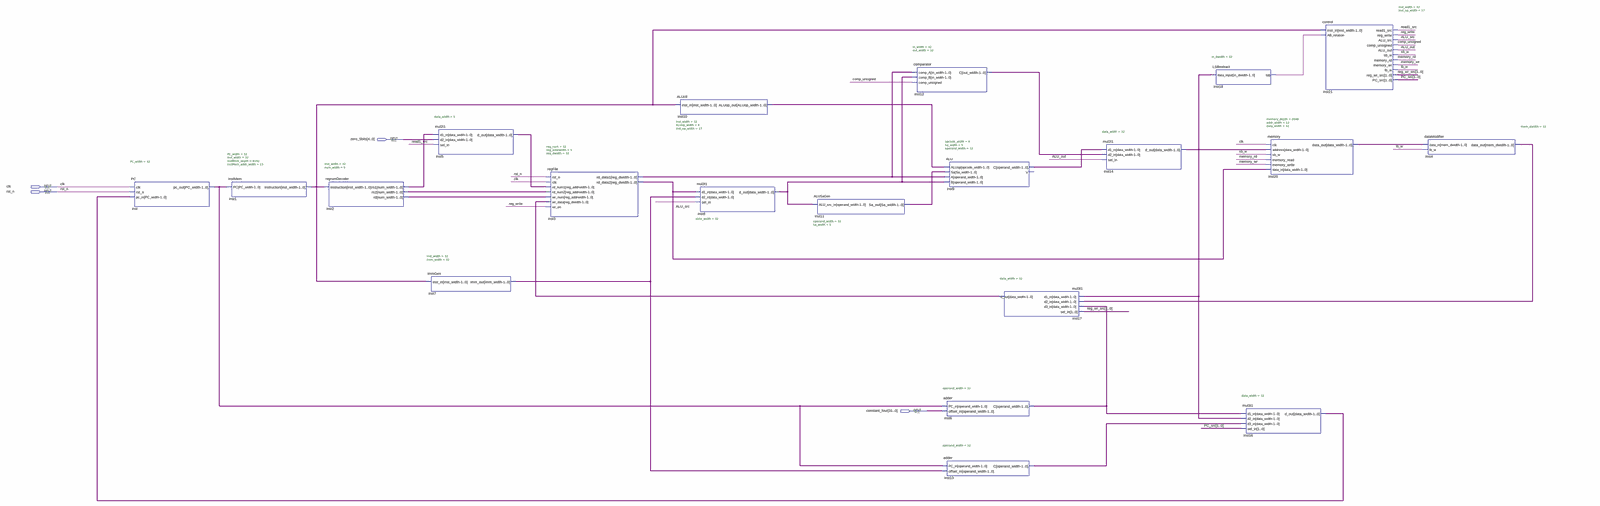
[diagram p0: schematic sheet, whole]
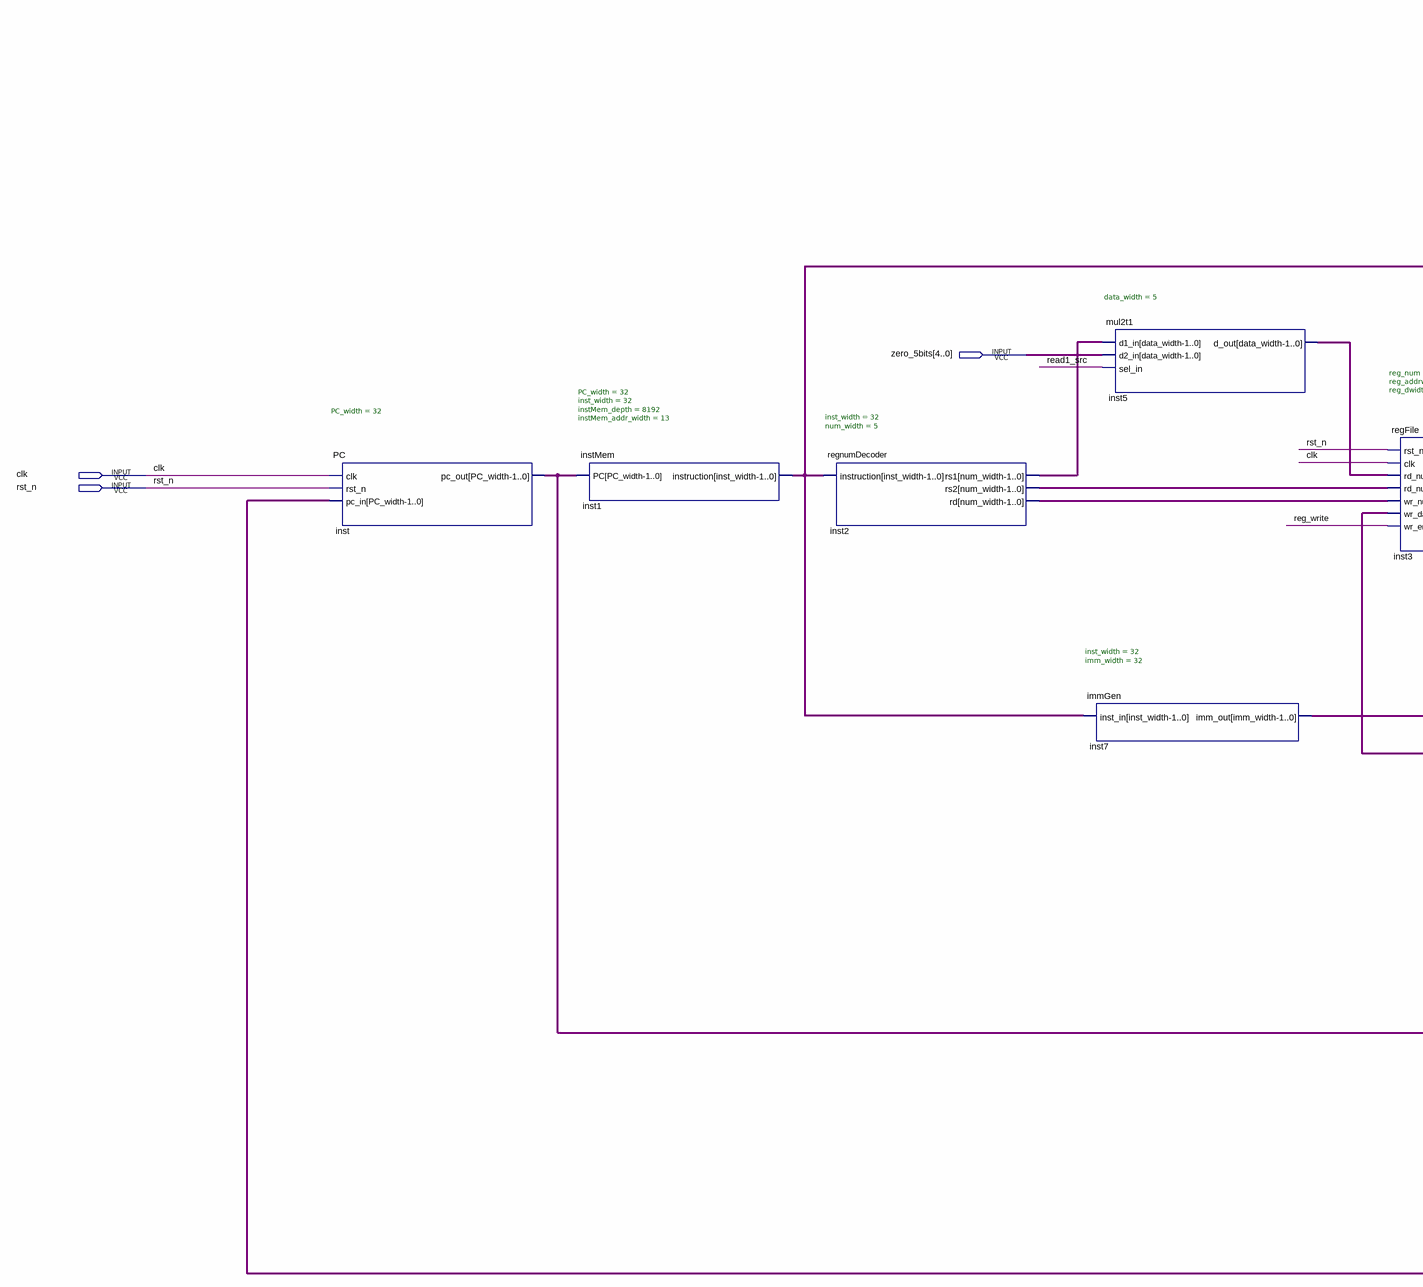
[diagram p1: schematic sheet, left part]
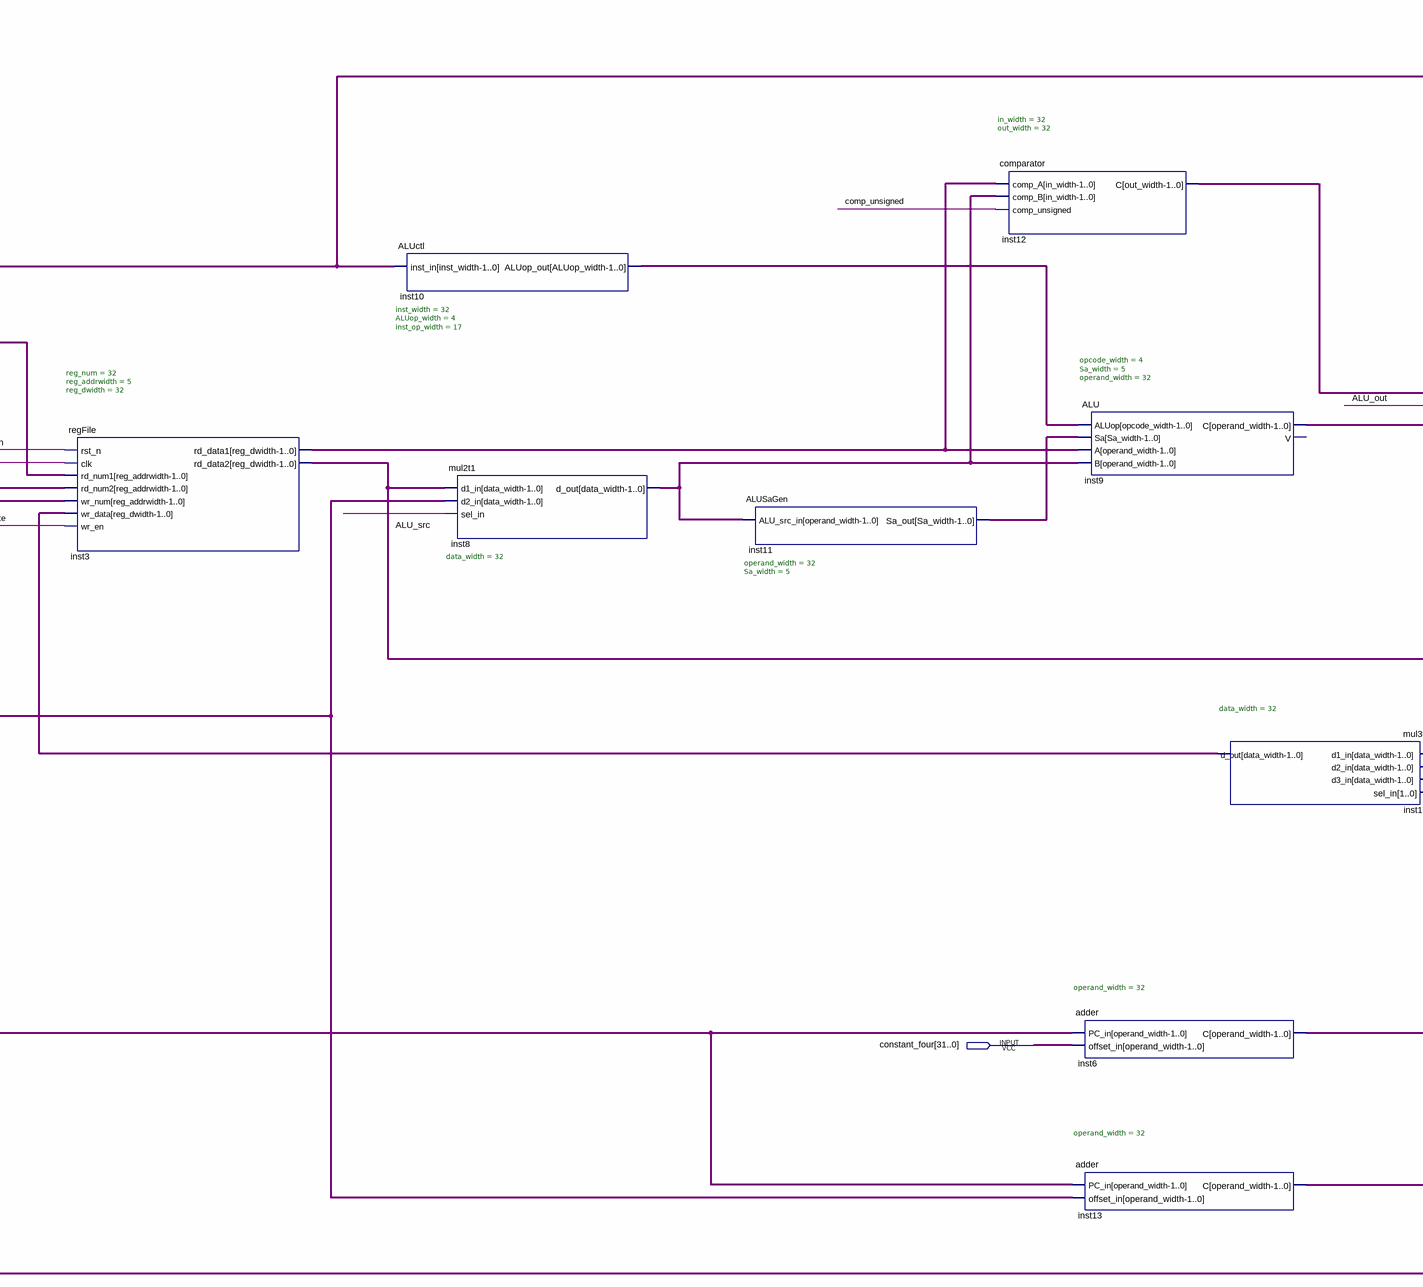
[diagram p2: schematic sheet, centre part]
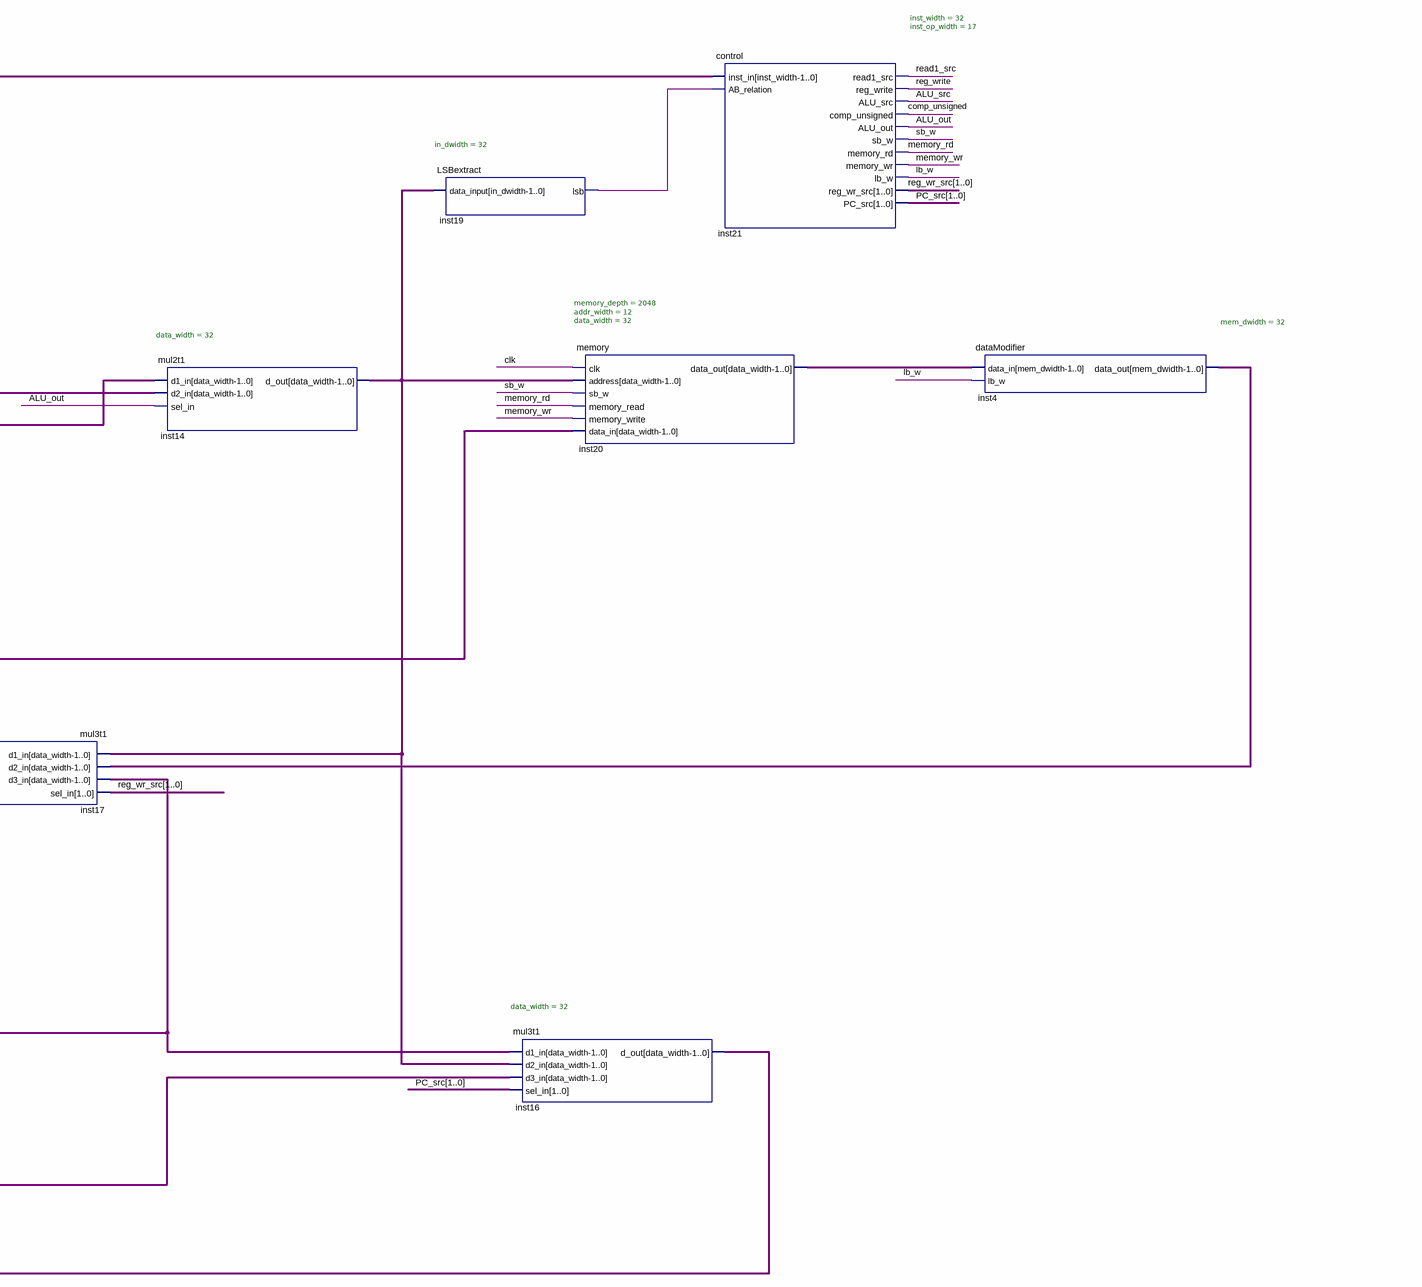
[diagram p3: schematic sheet, right part]
// Quartus schematic non_pipeline.bdf as structural Verilog: 20 symbols, 4 pins
module non_pipeline (
  input  [4:0] zero_5bits,
  input  clk,
  input  rst_n,
  input  [31:0] constant_four
);

  wire ALU_out, ALU_src, comp_unsigned, inst19_lsb, lb_w, memory_rd, memory_wr, read1_src, reg_write, sb_w;
  wire [1:0] PC_src, reg_wr_src;
  wire [3:0] inst10_aluop_out;
  wire [4:0] inst2_rd, inst2_rs1, inst2_rs2, inst5_d_out, inst11_sa_out;
  wire [31:0] inst1_instruction, inst3_rd_data1, inst3_rd_data2, inst4_data_out, inst6_c, inst7_imm_out,
       inst8_d_out, inst9_c, inst12_c, inst13_c, inst14_d_out, inst16_d_out, inst17_d_out, inst20_data_out,
       inst_pc_out;

  PC #(.PC_width(32)) inst (.clk(clk), .rst_n(rst_n), .pc_in(inst16_d_out), .pc_out(inst_pc_out));
  instMem #(.PC_width(32), .inst_width(32), .instMem_depth(8192), .instMem_addr_width(13)) inst1 (
    .PC(inst_pc_out), .instruction(inst1_instruction));
  regnumDecoder #(.inst_width(32), .num_width(5)) inst2 (
    .instruction(inst1_instruction), .rs1(inst2_rs1), .rs2(inst2_rs2), .rd(inst2_rd));
  immGen #(.inst_width(32), .imm_width(32)) inst7 (.inst_in(inst1_instruction), .imm_out(inst7_imm_out));
  mul2t1 #(.data_width(5)) inst5 (.d1_in(inst2_rs1), .d2_in(zero_5bits), .sel_in(read1_src), .d_out(inst5_d_out));
  regFile #(.reg_num(32), .reg_addrwidth(5), .reg_dwidth(32)) inst3 (
    .rst_n(rst_n), .clk(clk), .rd_num1(inst5_d_out), .rd_num2(inst2_rs2), .wr_num(inst2_rd),
    .wr_data(inst17_d_out), .wr_en(reg_write), .rd_data1(inst3_rd_data1), .rd_data2(inst3_rd_data2));
  ALUctl #(.inst_width(32), .ALUop_width(4), .inst_op_width(17)) inst10 (
    .inst_in(inst1_instruction), .ALUop_out(inst10_aluop_out));
  mul2t1 #(.data_width(32)) inst8 (
    .d1_in(inst3_rd_data2), .d2_in(inst7_imm_out), .sel_in(ALU_src), .d_out(inst8_d_out));
  ALUSaGen #(.operand_width(32), .Sa_width(5)) inst11 (.ALU_src_in(inst8_d_out), .Sa_out(inst11_sa_out));
  comparator #(.in_width(32), .out_width(32)) inst12 (
    .comp_A(inst3_rd_data1), .comp_B(inst8_d_out), .comp_unsigned(comp_unsigned), .C(inst12_c));
  ALU #(.opcode_width(4), .Sa_width(5), .operand_width(32)) inst9 (
    .ALUop(inst10_aluop_out), .Sa(inst11_sa_out), .A(inst3_rd_data1), .B(inst8_d_out), .C(inst9_c));  // open: V
  adder #(.operand_width(32)) inst6 (.PC_in(inst_pc_out), .offset_in(constant_four), .C(inst6_c));
  adder #(.operand_width(32)) inst13 (.PC_in(inst_pc_out), .offset_in(inst7_imm_out), .C(inst13_c));
  mul3t1 #(.data_width(32)) inst17 (
    .d1_in(inst14_d_out), .d2_in(inst4_data_out), .d3_in(inst6_c), .sel_in(reg_wr_src), .d_out(inst17_d_out));
  mul2t1 #(.data_width(32)) inst14 (.d1_in(inst9_c), .d2_in(inst12_c), .sel_in(ALU_out), .d_out(inst14_d_out));
  LSBextract #(.in_dwidth(32)) inst19 (.data_input(inst14_d_out), .lsb(inst19_lsb));
  mul3t1 #(.data_width(32)) inst16 (
    .d1_in(inst6_c), .d2_in(inst14_d_out), .d3_in(inst13_c), .sel_in(PC_src), .d_out(inst16_d_out));
  memory #(.memory_depth(2048), .addr_width(12), .data_width(32)) inst20 (
    .clk(clk), .address(inst14_d_out), .sb_w(sb_w), .memory_read(memory_rd), .memory_write(memory_wr),
    .data_in(inst3_rd_data2), .data_out(inst20_data_out));
  control #(.inst_width(32), .inst_op_width(17)) inst21 (
    .inst_in(inst1_instruction), .AB_relation(inst19_lsb), .read1_src(read1_src), .reg_write(reg_write),
    .ALU_src(ALU_src), .comp_unsigned(comp_unsigned), .ALU_out(ALU_out), .sb_w(sb_w), .memory_rd(memory_rd),
    .memory_wr(memory_wr), .lb_w(lb_w), .reg_wr_src(reg_wr_src), .PC_src(PC_src));
  dataModifier #(.mem_dwidth(32)) inst4 (.data_in(inst20_data_out), .lb_w(lb_w), .data_out(inst4_data_out));
endmodule
